# EAGLE design accel_RevA (EAGLE 6.5.0)
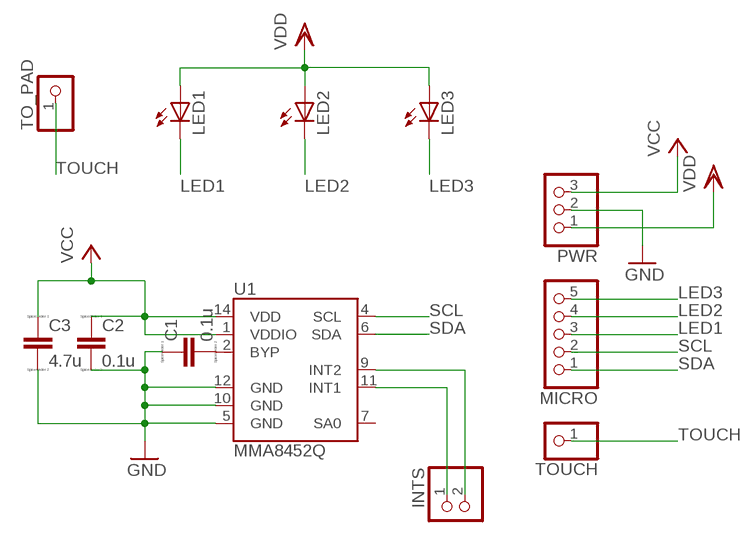
[diagram p0: schematic, sheet 1]

## Parts
C1  0.1u  CC0603  [C0603]
C2  0.1u  CC0603  [C0603]
C3  4.7u  CC0603  [C0603]
INTS  PINHD-1X2  [1X02]
LED1  LEDP-LCC-4  [P-LCC-4]
LED2  LEDP-LCC-4  [P-LCC-4]
LED3  LEDP-LCC-4  [P-LCC-4]
MICRO  PINHD-1X5  [1X05]
PWR  PINHD-1X3  [1X03]
TO_PAD  PINHD-1X1  [1X01]
TOUCH  PINHD-1X1  [1X01]
U1  MMA8452Q  [QFN-16_0.5MM]

## Nets
GND: C1.1 C2.2 C3.2 PWR.2 U1.5(GND) U1.10(GND) U1.12(GND)
LED1: LED1.C@4(C) MICRO.3
LED2: LED2.C@4(C) MICRO.4
LED3: LED3.C@4(C) MICRO.5
N$1: INTS.1 U1.11(INT1)
N$2: INTS.2 U1.9(INT2)
N$3: C1.2 U1.2(BYP)
SCL: MICRO.2 U1.4(SCL)
SDA: MICRO.1 U1.6(SDA)
TOUCH: TO_PAD.1 TOUCH.1
VCC: C2.1 C3.1 PWR.3 U1.1(VDDIO) U1.14(VDD)
VDD: LED1.A LED2.A LED3.A PWR.1
Unconnected: U1.7(SA0)

## Library data of the parts
C1-C3 = eagle-ltspice:C: CAPACITOR, European symbol; SPICEMODEL: NONE; SPICEPREFIX: C
INTS = pinhead:PINHD-1X2: PIN HEADER
LED1-LED3 = led:LED: LED OSRAM: - CHIPLED LG R971, LG N971, LY N971, LG Q971, LY Q971, LO R971, LY R971 LH N974, LH R974 LS Q976, LO Q976, LY Q976 LO Q996 - Hyper CHIPLED LW Q18S LB Q993, LB Q99A, LB R99A - SideLED LS A670, LO A670, LY A670, LG A670, LP A670 LB A673, LV A673, LT A673, LW A673 LH A674 LY A675 LS A676, LA A676, LO A676, LY A676, LW A676 LS A679, LY A679, LG A679 - Hyper Micro SIDELED® LS Y876, LA Y876, LO Y876, LY Y876 LT Y87S - SmartLED LW L88C, LW L88S LB L89C, LB L89S, LG L890 LS L89K, LO L89K, LY L89K LS L896, LA L896, LO L896, LY L896 - TOPLED LS T670, LO T670, LY T670, LG T670, LP T670 LSG T670, LSP T670, LSY T670, LOP T670, LYG T670 LG T671, LOG T671, LSG T671 LB T673, LV T673, LT T673, LW T673 LH T674 LS T676, LA T676, LO T676, LY T676, LB T676, LH T676, LSB T676, LW T676 LB T67C, LV T67C, LT T67C, LS T67K, LO T67K, LY T67K, LW E67C LS E67B, LA E67B, LO E67B, LY E67B, LB E67C, LV E67C, LT E67C LW T67C LS T679, LY T679, LG T679 LS T770, LO T770, LY T770, LG T770, LP T770 LB T773, LV T773, LT T773, LW T773 LH T774 LS E675, LA E675, LY E675, LS T675 LS T776, LA T776, LO T776, LY T776, LB T776 LHGB T686 LT T68C, LB T68C - Hyper Mini TOPLED® LB M676 - Mini TOPLED Santana® LG M470 LS M47K, LO M47K, LY M47K Source: http://www.osram.convergy.de LUXEON: - LUMILED® LXK2-PW12-R00, LXK2-PW12-S00, LXK2-PW14-U00, LXK2-PW14-V00 LXK2-PM12-R00, LXK2-PM12-S00, LXK2-PM14-U00 LXK2-PE12-Q00, LXK2-PE12-R00, LXK2-PE12-S00, LXK2-PE14-T00, LXK2-PE14-U00 LXK2-PB12-K00, LXK2-PB12-L00, LXK2-PB12-M00, LXK2-PB14-N00, LXK2-PB14-P00, LXK2-PB14-Q00 LXK2-PR12-L00, LXK2-PR12-M00, LXK2-PR14-Q00, LXK2-PR14-R00 LXK2-PD12-Q00, LXK2-PD12-R00, LXK2-PD12-S00 LXK2-PH12-R00, LXK2-PH12-S00 LXK2-PL12-P00, LXK2-PL12-Q00, LXK2-PL12-R00 Source: www.luxeon.com KINGBRIGHT: KA-3528ASYC Source: www.kingbright.com
MICRO = pinhead:PINHD-1X5: PIN HEADER
PWR = pinhead:PINHD-1X3: PIN HEADER
TO_PAD TOUCH = pinhead:PINHD-1X1: PIN HEADER
U1 = SparkFun-Sensors:MMA8452Q: MMA8452Q 3-Axis, 12/8-bit Digital Accelerometer Supply Voltage: 1.6-3.6V Range: +/- 2g, 4g, 8g Interface: I2C, 12-bit and 8-bit ODR: 1.56 Hz - 800 Hz Package: QFN-16 http://cache.freescale.com/files/sensors/doc/data_sheet/MMA8452Q.pdf; PROD_ID: IC-10769

## Board
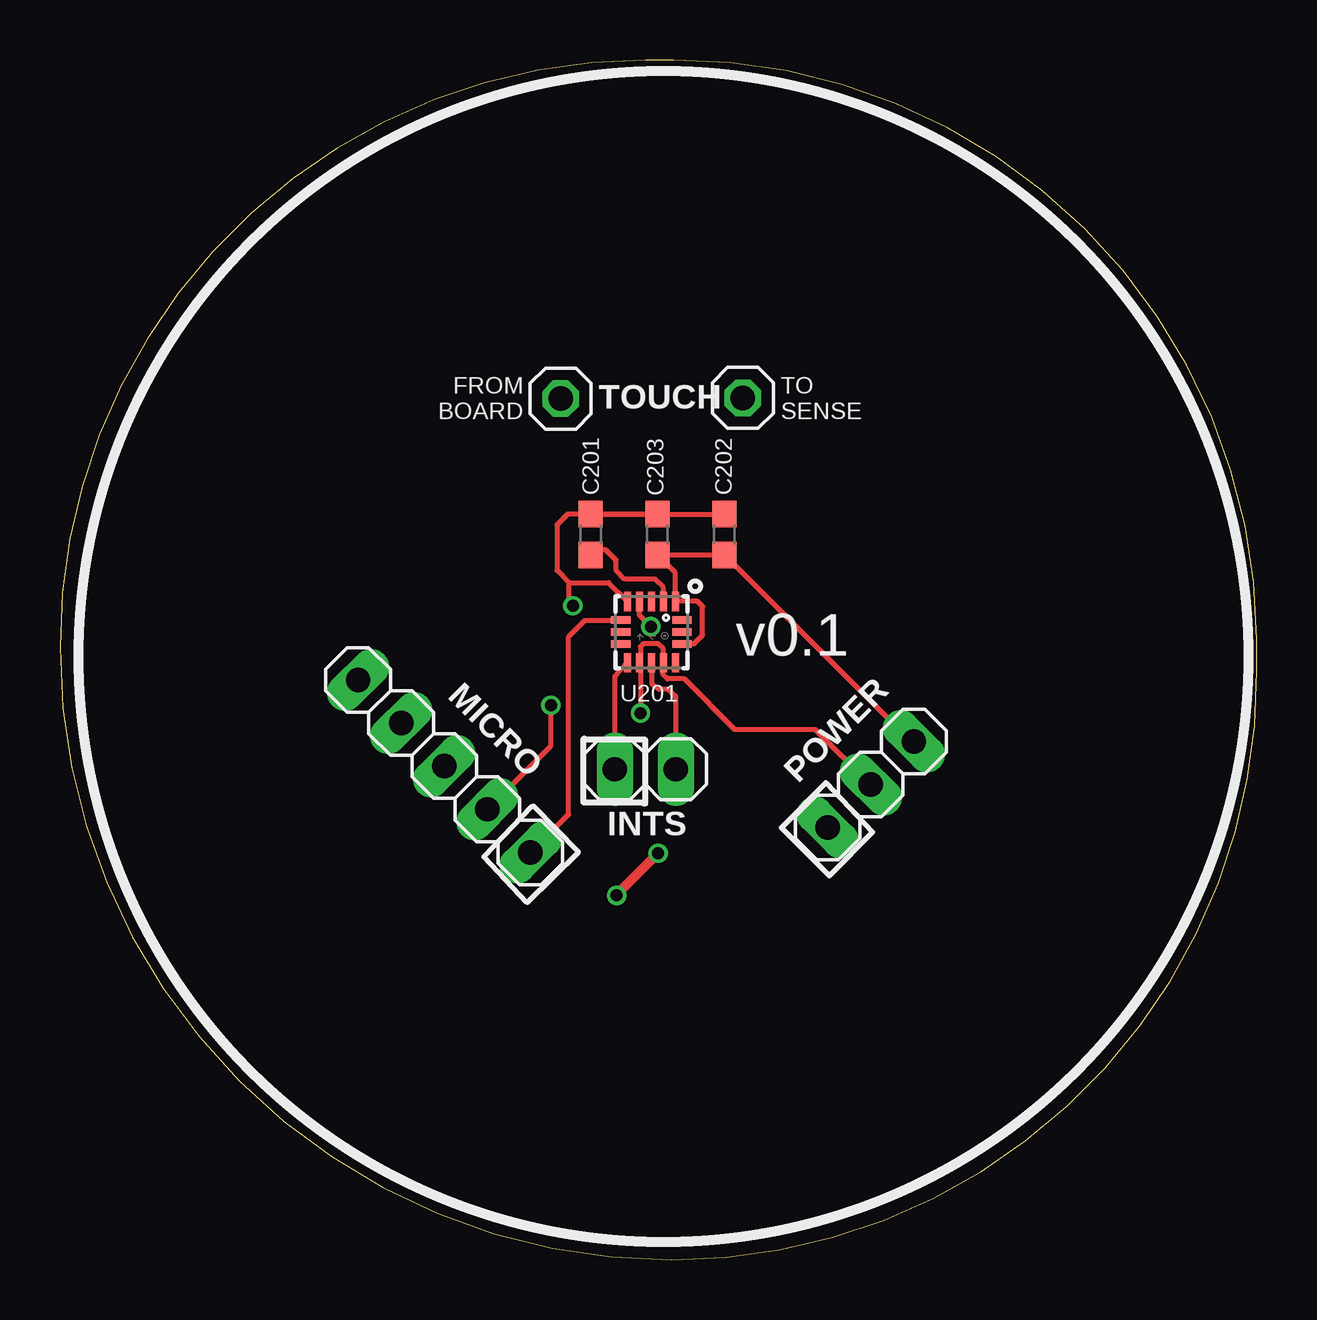
[diagram p1: board, top side]
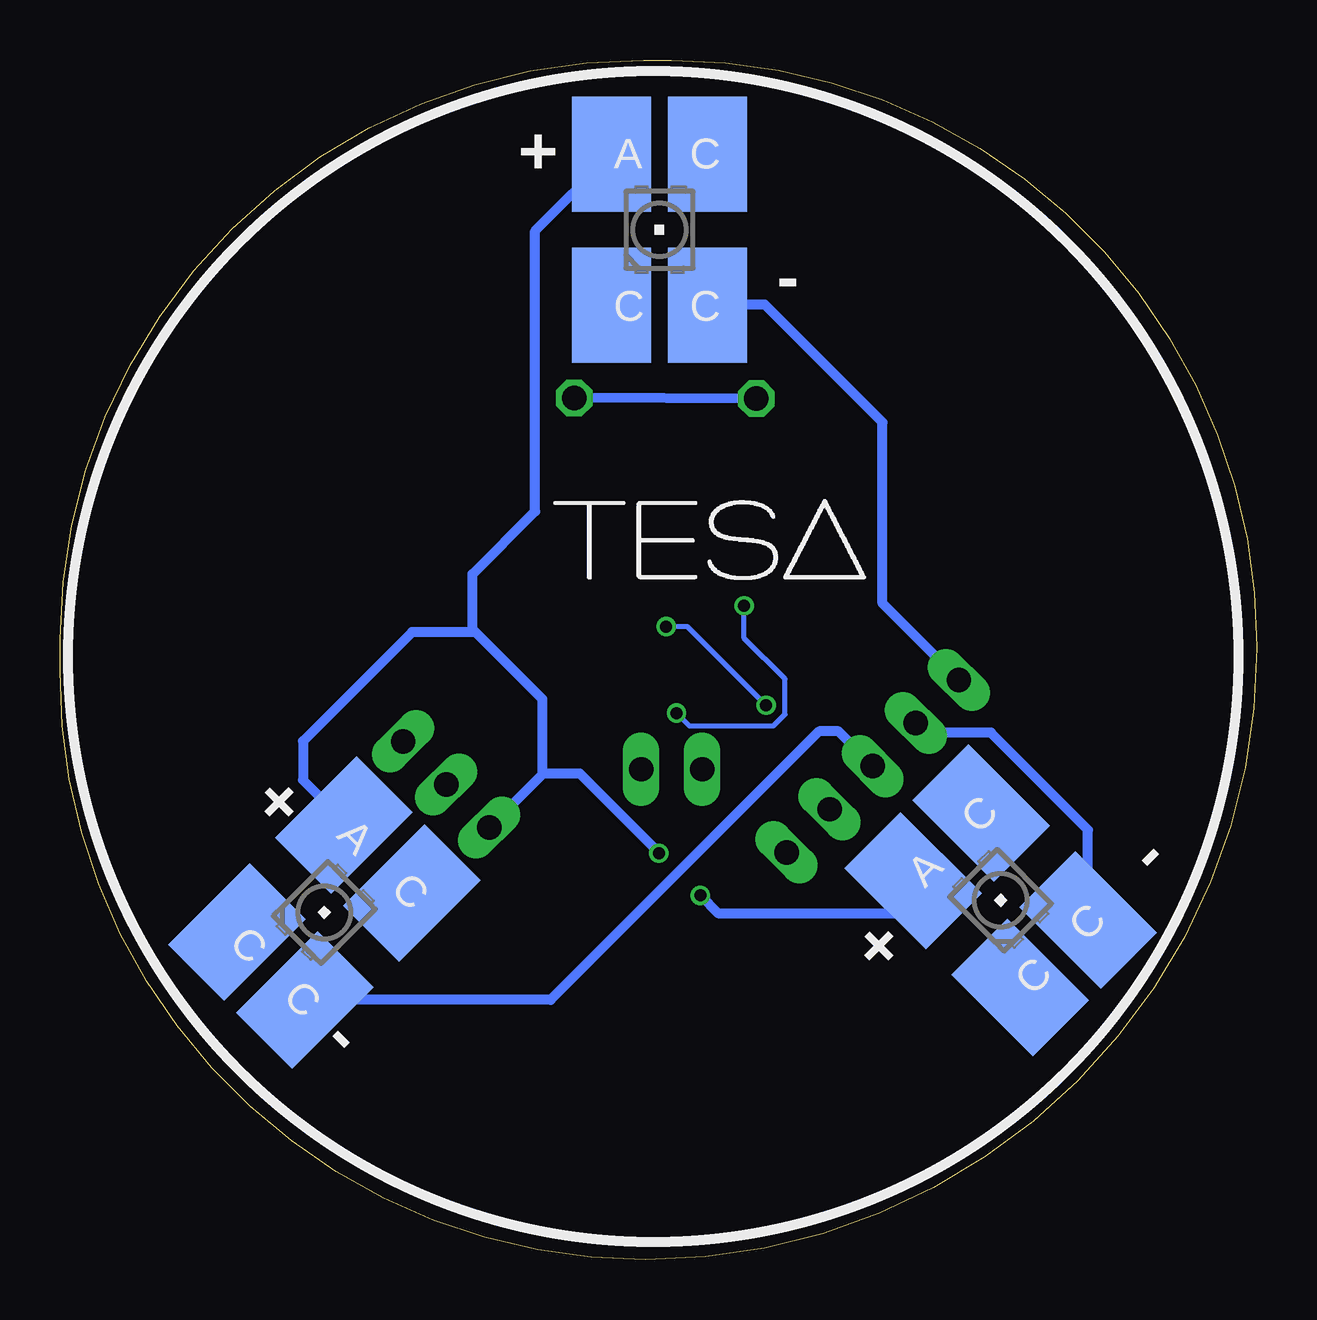
[diagram p2: board, bottom side, seen from below]

Size 49.89 x 50 mm. Coordinates in mm from the lower left corner, seen from the top.
Outline: 0,25.55 0,25.48 arc90 25.5,0 arc90 49.89,24.52 49.89,25.87 arc90 25.58,50 24.41,49.99 arc90 0,25.55
Copper layers (1*16): Top 0.035mm / dielectric 1.5mm / Bottom 0.035mm
Design rules "ITEADstudio_DRC": minimum track width 6mil, minimum drill 12mil, track to track 6mil, track to pad 6mil, pad to pad 6mil, via to via 6mil, smd to smd 0mil, copper to edge 10mil, drill to drill 10mil, minimum pad ring 10mil, minimum via ring 6mil, stop-mask expansion 2mil, vias tented up to drill 100mil, thermal gap 10mil

### Footprints (pad centres in the part's own frame; a part is rotated, then mirrored left to right if it is on the bottom)
C0603 = smd 1.1 x 1: 1 -0.85,0; 2 0.85,0
1X02 = drill 1.016 long: 1 -1.27,0; 2 1.27,0
P-LCC-4 = smd 3.3 x 4.8: A -2,3.15; C@1 -2,-3.15; C@3 2,3.15; C@4 2,-3.15
1X05 = drill 1.016 long: 1 -5.08,0; 2 -2.54,0; 3 0,0; 4 2.54,0; 5 5.08,0
1X03 = drill 1.016 long: 1 -2.54,0; 2 0,0; 3 2.54,0
1X01 = drill 1.016 octagon: 1 0,0
QFN-16_0.5MM = smd 0.8 x 0.3: 1 -1.275,1; 2 -1.275,0.5; 3 -1.275,0; 4 -1.275,-0.5; 5 -1.275,-1; 9 1.275,-1; 10 1.275,-0.5; 11 1.275,0; 12 1.275,0.5; 13 1.275,1 | smd 0.3 x 0.8: 6 -0.5,-1.275; 7 0,-1.275; 8 0.5,-1.275; 14 0.5,1.275; 15 0,1.275; 16 -0.5,1.275

### Placement (x,y rotation side)
C1  22.11,30.23 270 top
C2  27.7,30.23 90 top
C3  24.91,30.23 90 top
INTS  24.4,20.45 180 top
LED1  38.88,14.48 315 bottom
LED2  10.68,14.99 45 bottom
LED3  24.91,42.93 0 bottom
MICRO  16.02,20.57 135 top
PWR  33.8,19.81 45 top
TO_PAD  28.46,35.92 0 top
TOUCH  20.87,35.89 0 top
U1  24.65,26.16 270 top

### Tracks (layer width: path | path; a pad name or v marks a point on that pad's centre or on a via)
GND  (via drill 0.5 pad 0.2)
  Top 0.203: C1.1 C3.2 | C3.2 C2.2 | C3.2 21.16,31.08 20.72,30.63 20.72,28.73 21.22,28.22 | 21.22,28.22 22.87,28.22 U1.5 | PWR.2 33.77,19.81 31.49,22.1 28.13,22.1 26.03,24.21 25.31,24.21 25.14,24.38 25.14,24.87 U1.12 25.15,25.46 24.93,25.68 24.32,25.68 24.2,25.55 24.2,24.93 | 24.2,24.93 U1.10 | 24.2,24.93 v24.2,22.78 | v21.38,27.25 21.22,27.41 21.22,28.22
  Bottom 0.203: v24.2,22.78 23.66,22.25 20.16,22.25 19.68,22.73 19.68,24.21 21.38,25.91 v21.38,27.25
LED1
  Bottom 0.406: MICRO.3 16.02,20.6 17.44,22.02 18.25,22.02 29.44,10.84 LED1.C@4
LED2
  Bottom 0.406: LED2.C@4 7.04,17.92 11.09,21.97 13.82,21.97 MICRO.4
LED3
  Bottom 0.406: MICRO.5 15.61,27.36 15.61,34.9 20.51,39.8 22.88,39.8 LED3.C@4
N$1
  Top 0.203: INTS.1 25.67,23.47 25.31,23.77 24.96,23.77 24.68,23.98 24.68,24.86
  Top 0.254: 24.68,24.86 U1.11
N$2
  Top 0.203: INTS.2 23.13,24.31 U1.9
N$3
  Top 0.203: U1.2 25.15,28.02 24.81,28.37 23.54,28.37 23.18,28.73 23.18,29.16 22.75,29.59 22.33,29.59 C1.2
SCL  (via drill 0.5 pad 0.2)
  Top 0.203: MICRO.2 20.46,21.43 v20.46,23.11 | v24.63,26.39 24.15,26.86 U1.4
  Bottom 0.203: v20.46,23.11 23.74,26.39 v24.63,26.39
SDA
  Top 0.203: MICRO.1 21.2,18.57 21.2,25.96 21.88,26.64 23.36,26.64 U1.6
TOUCH
  Bottom 0.406: TOUCH.1 TO_PAD.1
VCC
  Top 0.203: PWR.3 35.47,21.61 C2.1 C3.1 25.65,28.63 U1.1 26.58,27.44 26.79,27.23 26.79,26.04 26.43,25.68 25.95,25.68 U1.14
VDD  (via drill 0.5 pad 0.41)
  Top 0.406: v24.93,16.94 23.21,15.21 v23.21,15.19
  Bottom 0.406: PWR.1 29.78,20.23 | 29.78,20.23 29.78,23.37 32.58,26.16 32.65,26.16 | 32.65,26.16 35.22,26.16 39.77,21.61 39.77,19.99 38.06,18.29 LED1.A | 32.65,26.16 32.71,26.21 32.71,28.57 30.09,31.19 30.09,42.88 26.91,46.06 LED3.A | 29.78,20.23 29.75,20.27 28.23,20.27 24.93,16.97 v24.93,16.94 | v23.21,15.19 22.47,14.45 14.39,14.45 14.33,14.52 LED2.A
(copper drawn outside any net)
  shapes: Bottom area x2740

### Text on the board
tPlace: FROM / BOARD | TOUCH | TO / SENSE | C201 | C203 | C202 | v0.1 | MICRO | U201 | POWER | INTS
bPlace: + | - | + | - | + | -